# EasyEDA schematic SCH_Hydrophonics_system.json
TITLE: Smart hydrophonics system; REV: 1.0; Date: 2022-10-31; Sheet: 1/1; Drawn By: Dixon Sunny; Company: Dixon Sunny
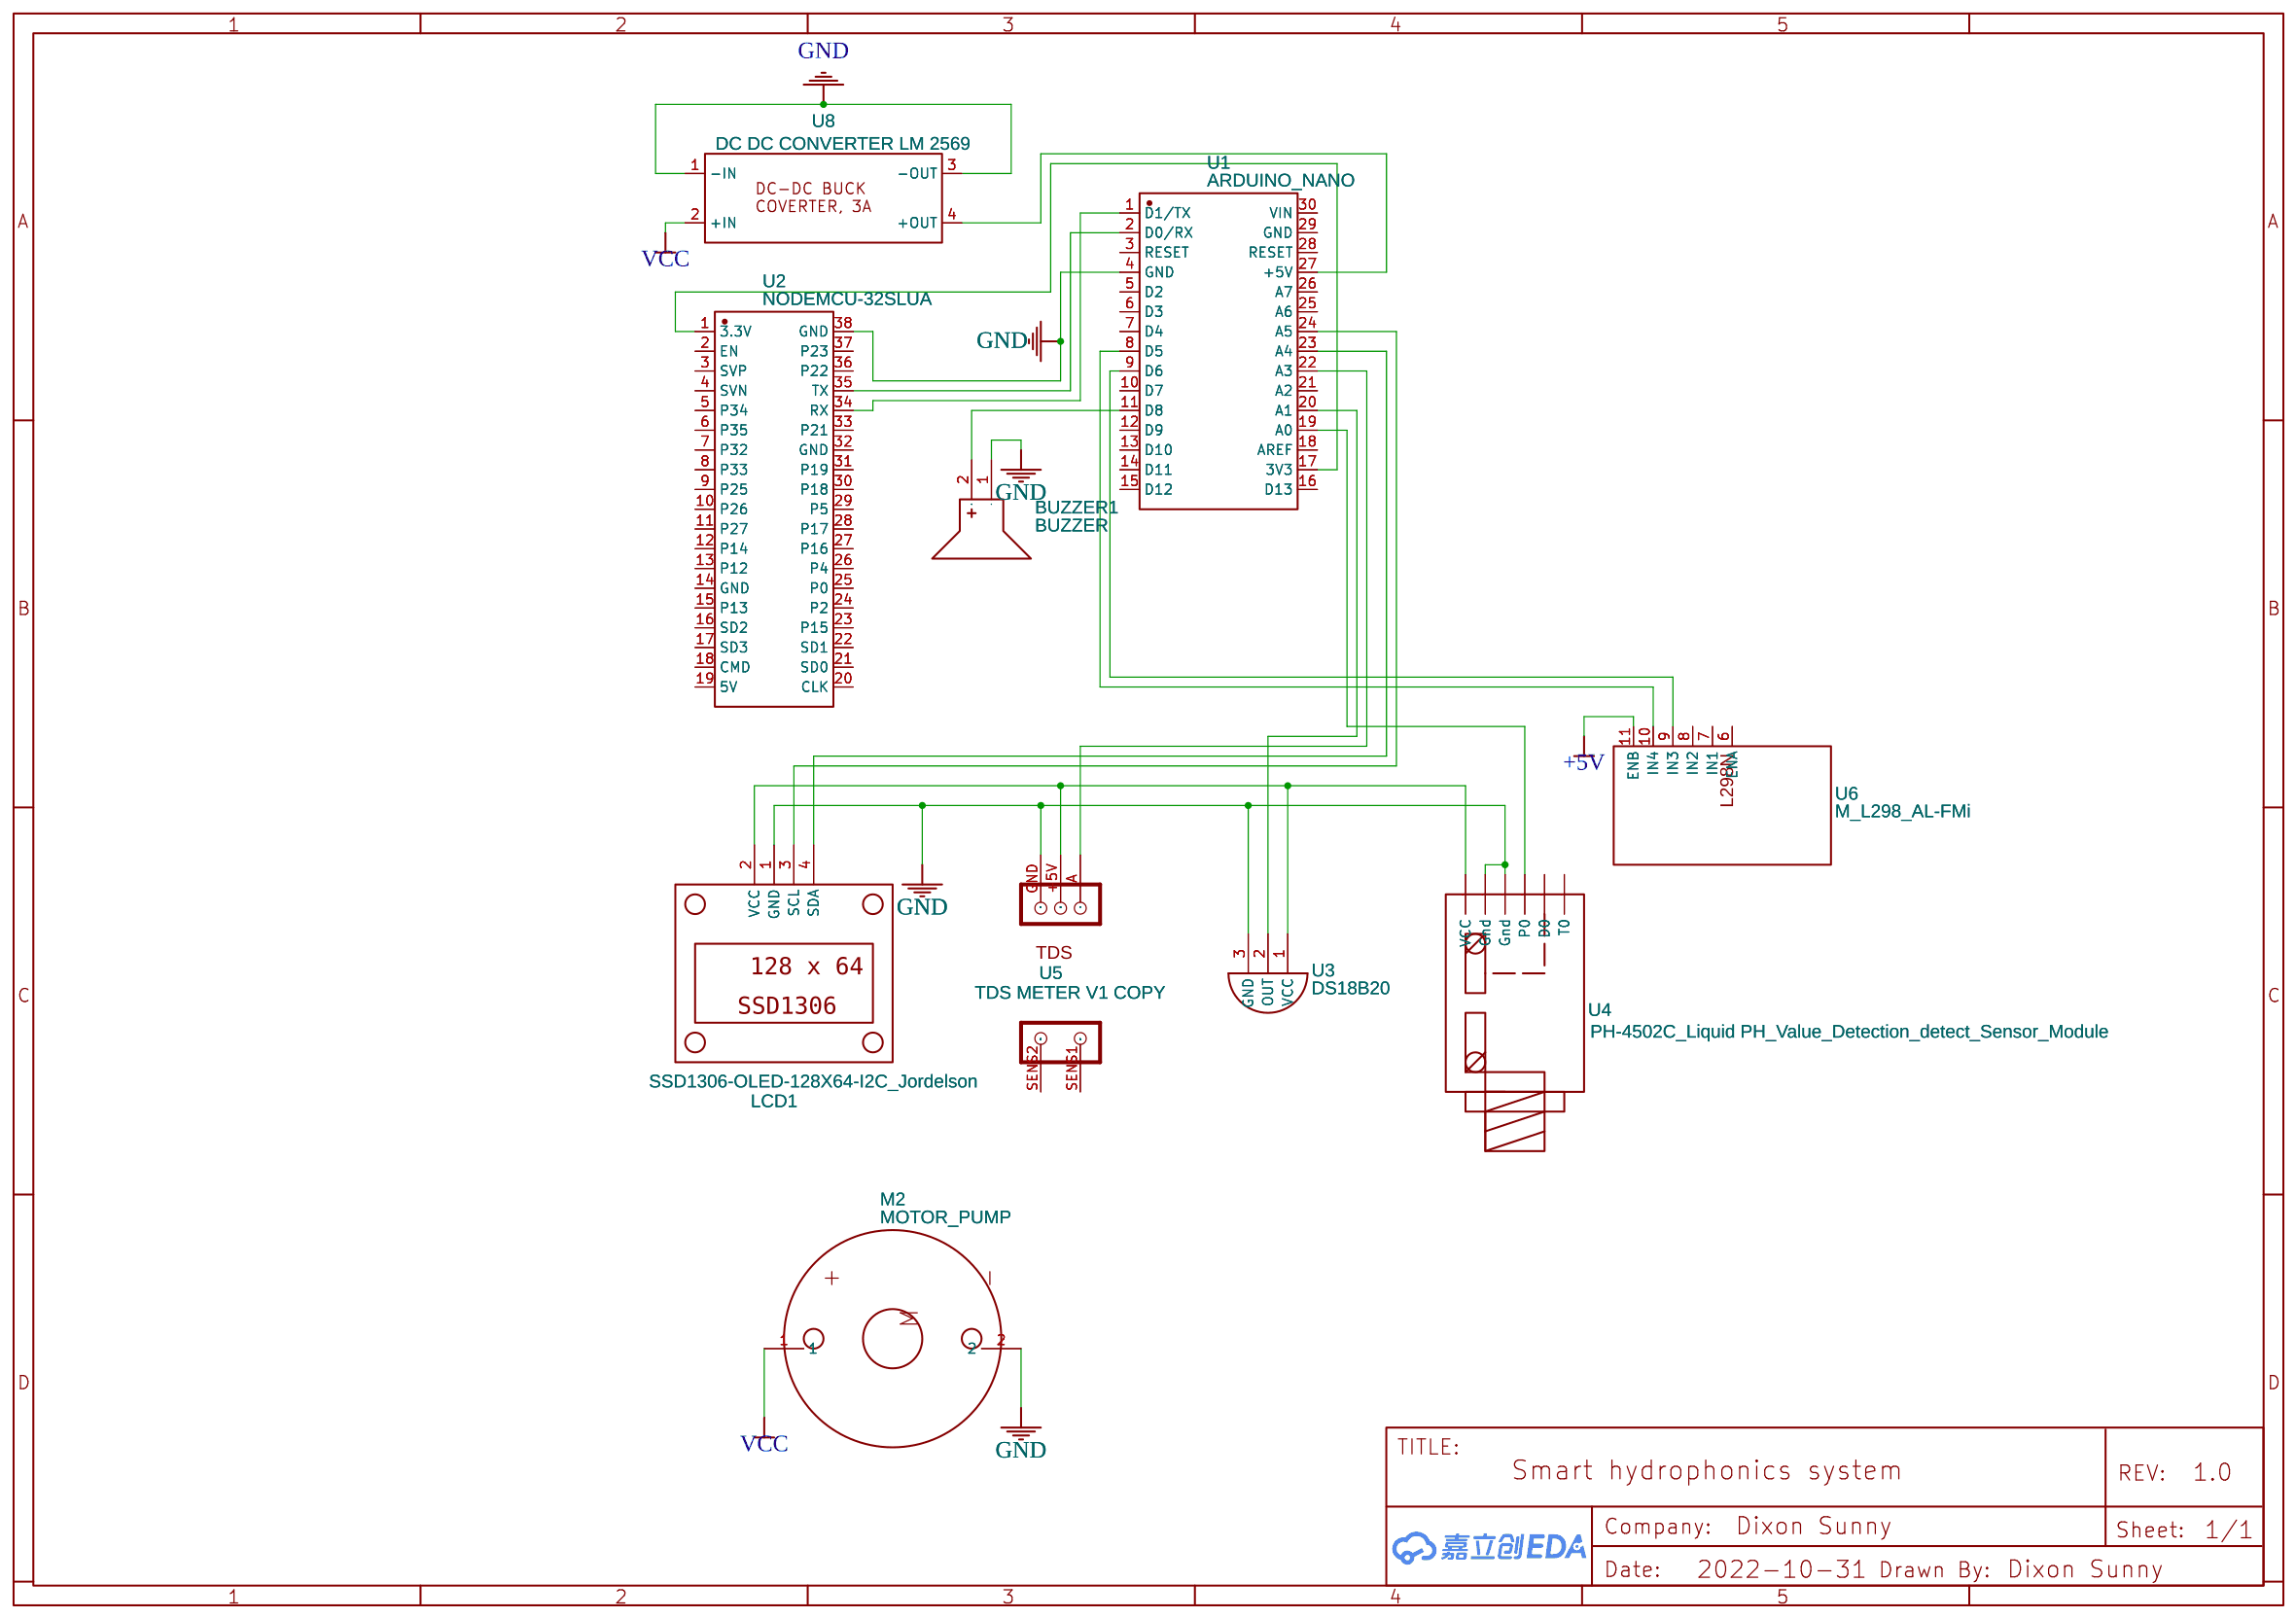
[diagram p0: schematic sheet]

## Parts
BUZZER1  BUZZER  [BUZ-TH_BD12.0-P6.00-D0.9-RD]
LCD1  SSD1306-OLED-128X64-I2C_Jordelson  [SSD1306-OLED-128X64-I2C]
M2  MOTOR_PUMP  [MOTOR_PUMP]
U1  ARDUINO_NANO  [COMM-TH_ARDUINO_NANO]
U2  NODEMCU-32SLUA  [COMM-TH_NODEMCU-32SLUA]
U3  DS18B20  [DS18B20]
U4  PH-4502C_Liquid PH_Value_Detection_detect_Sensor_Module  [PH_4502C_LIQUID_PH_VALUE_DETECTION_DETECT_SENSOR]
U5  TDS METER V1 COPY  [TDS METER V1.0 MIO]
U6  M_L298_AL-FMi  [M_L298N_AL]
U8  DC DC CONVERTER LM 2569  [3A-BUCK-CONVERTER]

## Library data of the parts
BUZZER1 = BUZZER: Contributor: lcsc; Supplier: LCSC; Supplier Part: C9900014030; Manufacturer: null; Manufacturer Part: buzzer; JLCPCB Part Class: Extended Part; link: https://lcsc.com/eda_search?q=C9900014030&%26type=1&ref=editor
LCD1 = SSD1306-OLED-128X64-I2C_Jordelson: Contributor: nuttphong.sa
M2 = MOTOR_PUMP: Contributor: sabixd5
U1 = ARDUINO_NANO: Contributor: lcsc; Supplier: LCSC; Supplier Part: C9900017879; Manufacturer: null; JLCPCB Part Class: Extended Part; link: https://lcsc.com/eda_search?q=C9900017879&%26type=1&ref=editor
U2 = NODEMCU-32SLUA: Contributor: lcsc; Supplier: LCSC; Supplier Part: C111436; Manufacturer: Ai-Thinker(安信可); Manufacturer Part: NodeMCU-32SLua; JLCPCB Part Class: Extended Part; link: https://lcsc.com/eda_search?q=C111436&%26type=1&ref=editor
U3 = DS18B20: Manufacturer Part: New SchematicLib; Contributor: felixzhdanov
U4 = PH-4502C_Liquid PH_Value_Detection_detect_Sensor_Module: Supplier: diymore; Contributor: coveyjorjet13
U5 = TDS METER V1 COPY: Contributor: lupus
U6 = M_L298_AL-FMi: Contributor: Florent MIRO
U8 = DC DC CONVERTER LM 2569: Manufacturer: A; Manufacturer Part: A; Supplier Part: AB; link: A; Contributor: jyotirmoy

## Nets
+5V: U6.11(ENB)
GND: BUZZER1.1(-) LCD1.1(GND) M2.2 U1.4(GND) U2.38(GND) U3.3(GND) U4.4(Gnd) U4.5(Gnd) U5.GND U8.1(-IN) U8.3(-OUT)
VCC: M2.1 U8.2(+IN)
Net-(BUZZER1-2): BUZZER1.2(+) U1.11(D8)
Net-(LCD1-2): LCD1.2(VCC) U3.1(VCC) U4.6(VCC) U5.+5V
Net-(LCD1-3): LCD1.3(SCL) U1.24(A5)
Net-(LCD1-4): LCD1.4(SDA) U1.23(A4)
Net-(U1-1): U1.1(D1/TX) U2.34(RX)
Net-(U1-2): U1.2(D0/RX) U2.35(TX)
Net-(U1-8): U1.8(D5) U6.10(IN4)
Net-(U1-9): U1.9(D6) U6.9(IN3)
Net-(U1-17): U1.17(3V3) U2.1(3.3V)
Net-(U1-19): U1.19(A0) U4.3(P0)
Net-(U1-20): U1.20(A1) U3.2(OUT)
Net-(U1-22): U1.22(A3) U5.A
Net-(U1-27): U1.27(+5V) U8.4(+OUT)

Not connected (* = marked no-connect by the designer): U1 3(RESET) 5(D2) 6(D3) 7(D4) 10(D7) 12(D9) 13(D10) 14(D11) 15(D12) 16(D13) 18(AREF) 21(A2) 25(A6) 26(A7) 28(RESET) 29(GND) 30(VIN); U2 2(EN) 3(SVP) 4(SVN) 5(P34) 6(P35) 7(P32) 8(P33) 9(P25) 10(P26) 11(P27) 12(P14) 13(P12) 14(GND) 15(P13) 16(SD2) 17(SD3) 18(CMD) 19(5V) 20(CLK) 21(SD0) 22(SD1) 23(P15) 24(P2) 25(P0) 26(P4) 27(P16) 28(P17) 29(P5) 30(P18) 31(P19) 32(GND) 33(P21) 36(P22) 37(P23); U4 1(T0) 2(D0); U5 SENS1 SENS2; U6 6(ENA) 7(IN1) 8(IN2)
